# EAGLE design tvbgone3 (EAGLE 6.4)
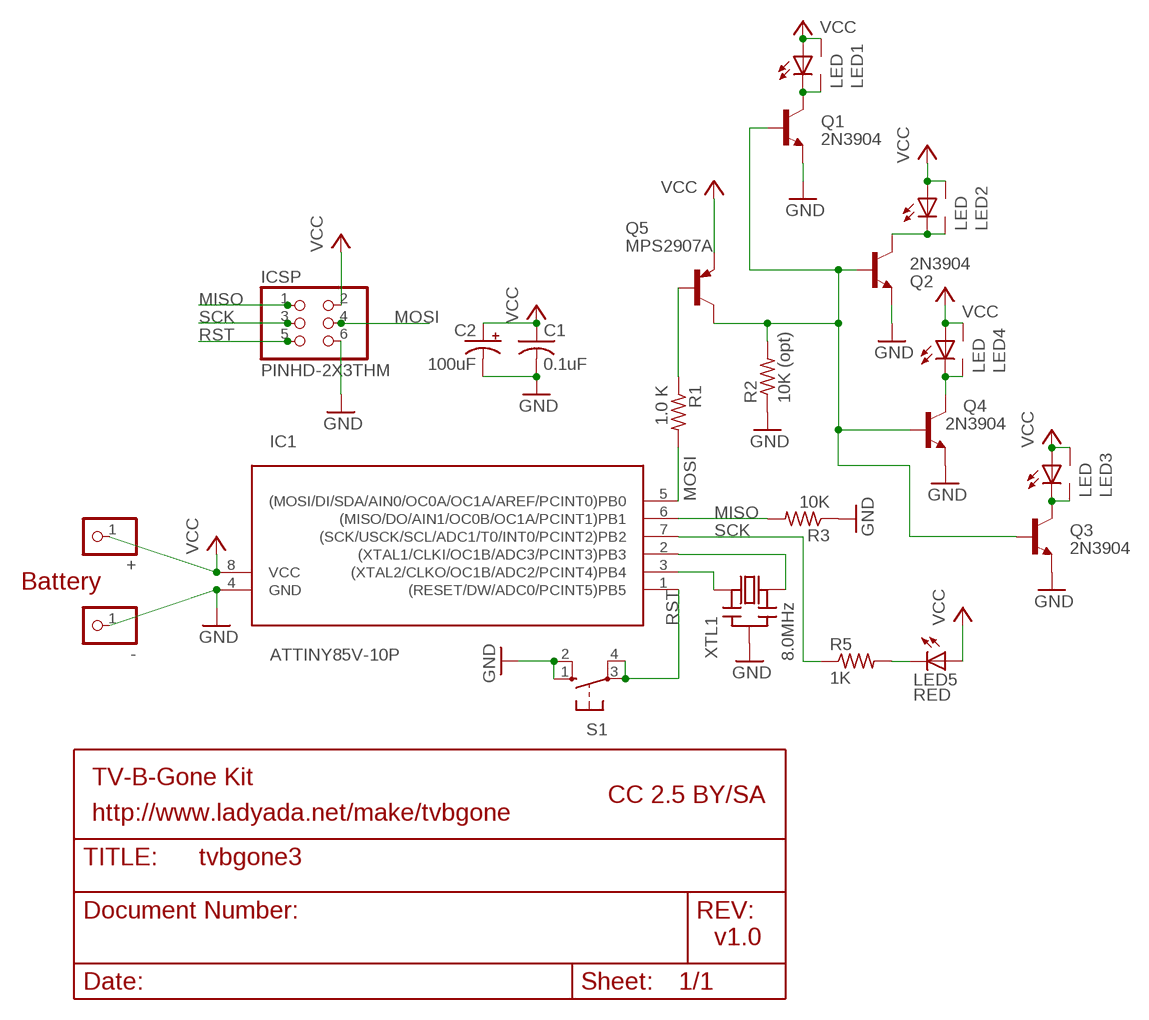
[diagram p0: schematic, sheet 1]

## Parts
+  PINHD-1X1  [1X01]
-  PINHD-1X1  [1X01]
C1  0.1uF  C-US025-025X050  [C025-025X050]
C2  100uF  CPOL-USE2.5-5  [E2,5-5]
IC1  ATTINY85V-10P  [DIL08]
ICSP  PINHD-2X3THM  [ISP6]
LED1  LED  [5MM-SIDE]
LED2  LED  [5MM-SIDE]
LED3  LED  [5MM-SIDE]
LED4  LED  [5MM-SIDE]
LED5  RED  LED3MM  [LED3MM]
Q1  2N3904  2N3904EZ  [TO92-EZ]
Q2  2N3904  2N3904EZ  [TO92-EZ]
Q3  2N3904  2N3904EZ  [TO92-EZ]
Q4  2N3904  2N3904EZ  [TO92-EZ]
Q5  MPS2907A  [TO92-CBE]
R1  1.0 K  R-US_0207/10  [0207/10]
R2  10K (opt)  R-US_0207/10  [0207/10]
R3  10K  R-US_0207/10  [0207/10]
R5  1K  R-US_0207/10  [0207/10]
S1  10-XX  [B3F-10XX]
XTL1  8.0MHz  CERMOSCILL  [CERM_OSC]

## Nets
GND: -.1 C1.2 C2.- IC1.4(GND) ICSP.6 Q1.3(E) Q2.3(E) Q3.3(E) Q4.3(E) R2.1 R3.1 S1.1(S) S1.2(S1) XTL1.P$2(GND)
MISO: IC1.6((MISO/DO/AIN1/OC0B/OC1A/PCINT1)PB1) ICSP.1 R3.2
MOSI: IC1.5((MOSI/DI/SDA/AIN0/OC0A/OC1A/AREF/PCINT0)PB0) ICSP.4 R1.2
N$1: IC1.3((XTAL2/CLKO/OC1B/ADC2/PCINT4)PB4) XTL1.P$1(IN)
N$2: IC1.2((XTAL1/CLKI/OC1B/ADC3/PCINT3)PB3) XTL1.P$3(OUT)
N$3: LED5.K(C) R5.2
N$6: Q5.B R1.1
N$7: LED4.K2(C1) LED4.K(C) Q4.1(C)
N$8: LED2.K2(C1) LED2.K(C) Q2.1(C)
N$9: LED3.K2(C1) LED3.K(C) Q3.1(C)
N$10: Q1.2(B) Q2.2(B) Q3.2(B) Q4.2(B) Q5.C R2.2
N$11: LED1.K2(C1) LED1.K(C) Q1.1(C)
RST: IC1.1((RESET/DW/ADC0/PCINT5)PB5) ICSP.5 S1.3(P) S1.4(P1)
SCK: IC1.7((SCK/USCK/SCL/ADC1/T0/INT0/PCINT2)PB2) ICSP.3 R5.1
VCC: +.1 C1.1 C2.+ IC1.8(VCC) ICSP.2 LED1.A LED1.A2(A1) LED2.A LED2.A2(A1) LED3.A LED3.A2(A1) LED4.A LED4.A2(A1) LED5.A Q5.E

## Notes on the sheet
- Battery
- TV-B-Gone Kit
- CC 2.5 BY/SA
- http://www.ladyada.net/make/tvbgone
- v1.0

## Library data of the parts
+ - = ybox2:PINHD-1X1: PIN HEADER
C1 = rcl-ez:C-US: CAPACITOR, American symbol
C2 = rcl-ez:CPOL-US: POLARIZED CAPACITOR, American symbol
IC1 = avr:ATTINY85: MICROCONTROLLER 8 Kbytes FLASH 512 bytes EEPROM 512 bytes RAM 4-channel 10 bit ADC USI
ICSP = adaprog:PINHD-2X3
LED1-LED4 = tvbgone:LED
LED5 = minimidi:LED: LED OSRAM: - CHIPLED LG R971, LG N971, LY N971, LG Q971, LY Q971, LO R971, LY R971 LH N974, LH R974 LS Q976, LO Q976, LY Q976 LO Q996 - Hyper CHIPLED LW Q18S LB Q993, LB Q99A, LB R99A - SideLED LS A670, LO A670, LY A670, LG A670, LP A670 LB A673, LV A673, LT A673, LW A673 LH A674 LY A675 LS A676, LA A676, LO A676, LY A676, LW A676 LS A679, LY A679, LG A679 - Hyper Micro SIDELED® LS Y876, LA Y876, LO Y876, LY Y876 LT Y87S - SmartLED LW L88C, LW L88S LB L89C, LB L89S, LG L890 LS L89K, LO L89K, LY L89K LS L896, LA L896, LO L896, LY L896 - TOPLED LS T670, LO T670, LY T670, LG T670, LP T670 LSG T670, LSP T670, LSY T670, LOP T670, LYG T670 LG T671, LOG T671, LSG T671 LB T673, LV T673, LT T673, LW T673 LH T674 LS T676, LA T676, LO T676, LY T676, LB T676, LH T676, LSB T676, LW T676 LB T67C, LV T67C, LT T67C, LS T67K, LO T67K, LY T67K, LW E67C LS E67B, LA E67B, LO E67B, LY E67B, LB E67C, LV E67C, LT E67C LW T67C LS T679, LY T679, LG T679 LS T770, LO T770, LY T770, LG T770, LP T770 LB T773, LV T773, LT T773, LW T773 LH T774 LS E675, LA E675, LY E675, LS T675 LS T776, LA T776, LO T776, LY T776, LB T776 LHGB T686 LT T68C, LB T68C - Hyper Mini TOPLED® LB M676 - Mini TOPLED Santana® LG M470 LS M47K, LO M47K, LY M47K Source: http://www.osram.convergy.de/
Q1-Q4 = transistor-npn:2N3904: NPN Transistor
Q5 = transistor-pnp:MPS2907*: PNP Transistror
R1-R3 R5 = rcl-ez:R-US_: RESISTOR, American symbol
S1 = switch-omron:10-XX: OMRON SWITCH
XTL1 = digg:CERMOSCILL

## Board
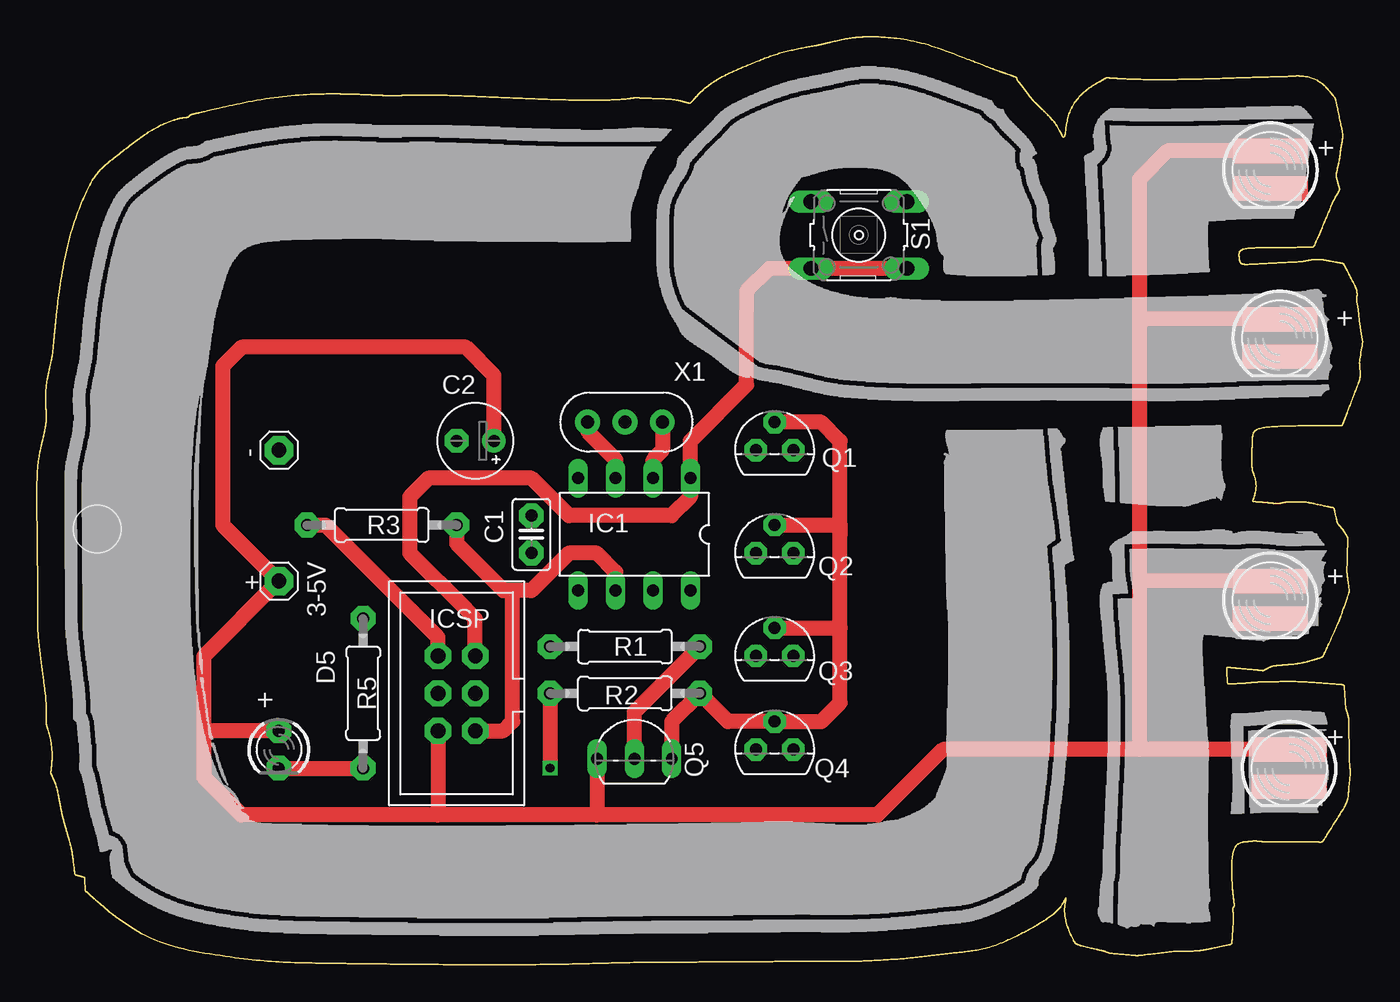
[diagram p1: board, top side]
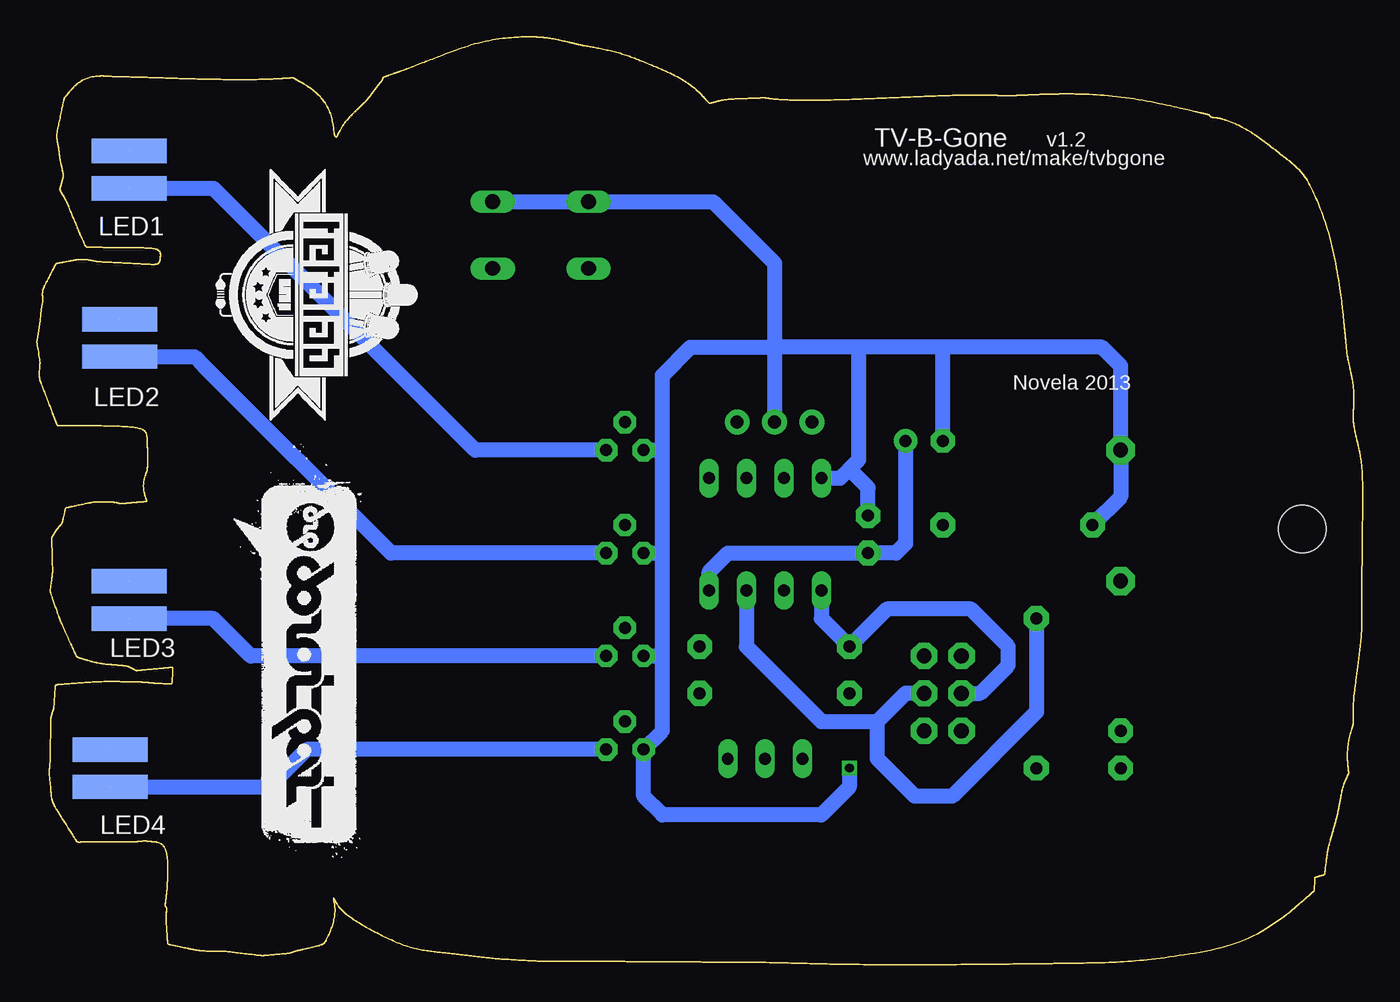
[diagram p2: board, bottom side, seen from below]

Size 90.01 x 63 mm. Coordinates in mm from the lower left corner, seen from the top.
Outline: 5211 segments
Copper layers (1*16): Top 0.035mm / dielectric 1.5mm / Bottom 0.035mm
Design rules "default *": minimum track width 10mil, minimum drill 20mil, track to track 12mil, track to pad 12mil, pad to pad 12mil, via to via 12mil, smd to smd 0mil, copper to edge 0mil, drill to drill 8mil, minimum pad ring 10mil, minimum via ring 8mil, stop-mask expansion 4mil, vias tented up to drill 0mil, thermal gap 24mil
Holes 3.2 mm at 4.1,29.58

### Footprints (pad centres in the part's own frame; a part is rotated, then mirrored left to right if it is on the bottom)
1X01 = drill 1.016 pad 1.93 octagon: 1 0,0
C025-025X050 = drill 0.813 pad 1.676 octagon: 1 -1.27,0; 2 1.27,0
E2,5-5 = drill 0.813 pad 1.6: + -1.27,0 | drill 0.813 pad 1.6 octagon: - 1.27,0
DIL08 = drill 0.813 long: 1 -3.81,-3.81; 2 -1.27,-3.81; 3 1.27,-3.81; 4 3.81,-3.81; 5 3.81,3.81; 6 1.27,3.81; 7 -1.27,3.81; 8 -3.81,3.81
ISP6 = drill 1.016 pad 1.778 octagon: 1 -2.54,-1.27; 2 -2.54,1.27; 3 0,-1.27; 4 0,1.27; 5 2.54,-1.27; 6 2.54,1.27
5MM-SIDE = smd 1.651 x 5.08: A -1.27,0; K 1.27,0 | smd 1.651 x 5.08 bottom: A2 -1.27,0; K2 1.27,0
LED3MM = drill 0.813 pad 1.676 octagon: A -1.27,0; K 1.27,0
TO92-EZ = drill 0.813 pad 1.524 octagon: 1 1.27,0; 2 0,1.905; 3 -1.27,0
TO92-CBE = drill 0.813 long: B 0,0; C 2.54,0; E -2.54,0
0207/10 = drill 0.813 pad 1.676 octagon: 1 -5.08,0; 2 5.08,0
B3F-10XX = drill 1.016 long: 1 -3.251,2.261; 2 3.251,2.261; 3 -3.251,-2.261; 4 3.251,-2.261
CERM_OSC = drill 0.9 pad 1.676: P$1 -2.54,0; P$2 0,0; P$3 2.54,0

### Placement (x,y rotation side)
+  16.43,26.04 0 top
-  16.43,34.93 0 top
C1  33.58,29.22 90 top
C2  29.77,35.57 180 top
IC1  40.56,29.22 180 top
ICSP  28.5,18.42 90 top
LED1  83.74,53.98 270 top
LED2  84.38,42.55 270 top
LED3  83.74,24.77 270 top
LED4  85.01,13.34 270 top
LED5  16.43,14.61 270 top
Q1  50.09,34.93 0 top
Q2  50.09,27.95 0 top
Q3  50.09,20.96 0 top
Q4  50.09,14.61 0 top
Q5  40.56,13.98 0 top
R1  39.93,21.6 180 top
R2  39.93,18.42 0 top
R3  23.42,29.85 0 top
R5  22.15,18.42 270 top
S1  55.8,49.54 0 top
XTL1  39.93,36.84 0 top

### Tracks (layer width: path | path; a pad name or v marks a point on that pad's centre or on a via)
GND  (via drill 0.6)
  Top 1.016: ICSP.6 27.23,22.23 21.51,27.95 19.61,29.85 R3.1 | R2.1 v34.85,13.34
  Bottom 1.016: 47.55,20.96 47.55,15.88 Q4.3 48.82,11.44 47.55,10.17 36.75,10.17 34.85,12.07 v34.85,13.34 | 47.55,20.96 47.55,27.95 | 47.55,27.95 47.55,33.66 47.55,34.93 | Q2.3 47.55,27.95 | Q3.3 47.55,20.96 | S1.2 S1.1 44.09,51.8 41.83,49.54 39.93,47.63 39.93,41.92 | 39.93,41.92 XTL1.P$2 | 47.55,34.93 47.55,40.01 45.64,41.92 39.93,41.92 | Q1.3 47.55,34.93 | C2.- 28.5,40.01 28.5,41.92 | 28.5,41.92 34.21,41.92 | 34.21,41.92 39.93,41.92 | 28.5,41.92 17.7,41.92 16.43,40.65 -.1 16.43,31.76 R3.1 | IC1.4 35.48,33.03 34.85,33.66 | 34.85,33.66 34.21,34.3 34.21,41.92 | C1.2 33.58,32.39 34.85,33.66
MISO
  Top 1.016: IC1.6 39.29,26.68 38.02,27.95 36.12,27.95 33.58,25.41 32.31,25.41 | 32.31,25.41 31.67,25.41 29.13,27.95 28.5,28.58 R3.2 | ICSP.1 31.67,15.88 32.31,16.52 32.31,25.41
MOSI
  Bottom 1.016: IC1.5 36.75,23.5 R1.2 32.31,24.14 26.59,24.14 24.05,21.6 24.05,20.33 25.96,18.42 ICSP.4
N$1
  Top 1.016: XTL1.P$1 37.39,36.2 39.29,34.3 IC1.3
N$2
  Top 1.016: IC1.2 41.83,34.3 42.47,34.93 XTL1.P$3
N$3
  Top 1.016: LED5.K R5.2
N$6
  Top 1.016: Q5.B 40.56,17.15 R1.1
N$7  (1 unrouted)
  Bottom 1.016: Q4.1 71.68,14.61 73.58,12.71 74.22,12.07 LED4.K2
N$8  (1 unrouted)
  Bottom 1.016: Q2.1 65.96,27.95 78.66,40.65 79.3,41.28 LED2.K2
N$9  (1 unrouted)
  Bottom 1.016: Q3.1 75.49,20.96 78.03,23.5 LED3.K2
N$10
  Top 1.016: 54.53,22.87 54.53,17.79 53.26,16.52 Q4.2 46.91,16.52 R2.2 43.1,16.52 Q5.C | 54.53,22.87 54.53,29.22 | 54.53,29.22 54.53,35.57 53.26,36.84 Q1.2 | Q2.2 54.53,29.85 54.53,29.22 | Q3.2 54.53,22.87
N$11  (1 unrouted)
  Bottom 1.016: Q1.1 60.25,34.93 78.03,52.71 LED1.K2
RST
  Top 1.016: S1.4 S1.3 49.73,47.28 48.18,45.73 48.18,44.46 48.18,39.38 44.37,35.57 IC1.1 44.37,31.76 43.1,30.49 36.12,30.49 33.58,33.03 26.59,33.03 25.32,31.76 25.32,27.95 29.13,24.14 29.77,23.5 ICSP.5
SCK
  Bottom 1.016: IC1.7 41.83,21.6 36.75,16.52 32.94,16.52 | 32.94,16.52 31.67,17.79 31.04,18.42 ICSP.3 | R5.1 22.15,17.15 27.86,11.44 30.4,11.44 32.94,13.98 32.94,16.52
VCC  (4 unrouted)
  Top 1.016: LED4.A2 74.85,14.61 | 74.85,14.61 61.52,14.61 57.07,10.17 38.02,10.17 | 38.02,10.17 27.23,10.17 | 27.23,10.17 13.89,10.17 11.35,12.71 11.35,15.88 | 11.35,15.88 11.35,20.96 +.1 12.62,29.85 12.62,40.65 13.89,41.92 29.13,41.92 31.04,40.01 C2.+ | LED5.A 11.35,15.88 | ICSP.2 27.23,10.17 | Q5.E 38.02,10.17 | LED1.A2 76.76,55.25 74.85,53.35 74.85,43.82 | 74.85,43.82 74.85,26.04 | 74.85,26.04 74.85,14.61 | LED2.A2 74.85,43.82 | LED3.A2 74.85,26.04
  Bottom 1.016: IC1.8 44.37,26.68 43.1,27.95 C1.1 31.67,27.95 31.04,28.58 C2.+

### Text on the board
tPlace: + | S1 | + | X1 | C2 | Q1 | IC1 | C1 | Q2 | + | 3-5V | D5 | Q3 | + | + | Q4
bPlace: v1.2 | TV-B-Gone | www.ladyada.net/make/tvbgone | LED1 | Novela 2013 | LED2 | LED3 | LED4
tDocu: TM